# EAGLE schematic Izklop_induktivnega_bremena (EAGLE 9.6.2)
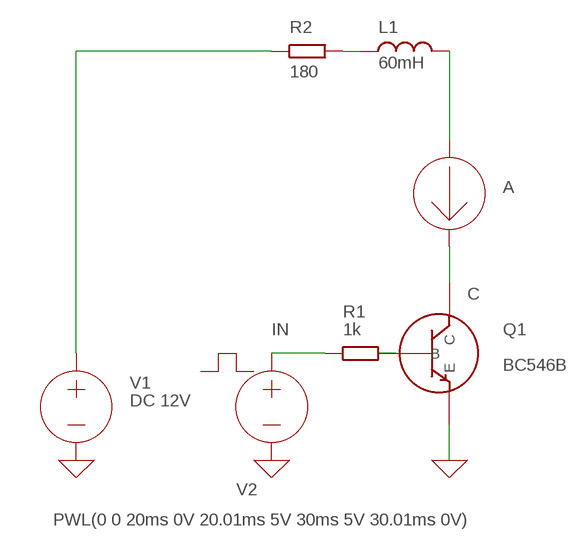
[diagram p0: schematic, sheet 1]

## Parts
A  AMMETER  (no package)
L1  60mH  L  (no package)
Q1  BC546B  BJT_NPN  (no package)
R1  1k  R  (no package)
R2  180  R  (no package)
V1  DC 12V  VOLTAGE  (no package)
V2  PWL(0 0 20ms 0V 20.01ms 5V 30ms 5V 30.01ms 0V)  VOLTAGE  (no package)

## Nets
0: Q1.E V1.- V2.- ; supply symbol labelled GND
C: A.- Q1.C
IN: R1.1 V2.+
N$1: A.+ L1.2
N$2: Q1.B R1.2
N$3: R2.1 V1.+
N$4: L1.1 R2.2

## Library data of the parts
A = ngspice-simulation:AMMETER: AMMETER
L1 = ngspice-simulation:L: INDUCTOR
Q1 = ngspice-simulation:BJT_NPN: Bipolar NPN Transistor; SPICEMODEL: BC546B; SPICEPREFIX: Q
R1 R2 = ngspice-simulation:R: RESISTOR
V1 V2 = ngspice-simulation:VOLTAGE: Independent Voltage Source, either DC, AC, PULSE, SINE, PWL, EXP, or SFFM; VALUE: 0V